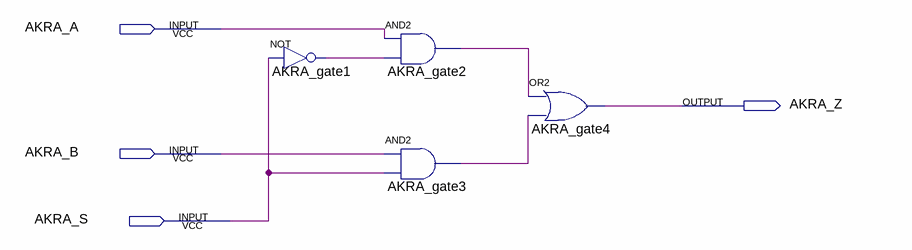
[diagram p0: schematic sheet]
// Quartus schematic Akram_Tutorial_MUX21_August_30_2021.bdf as structural Verilog: 4 symbols, 4 pins
module Akram_Tutorial_MUX21_August_30_2021 (
  input  AKRA_A,
  input  AKRA_B,
  input  AKRA_S,
  output AKRA_Z
);

  wire AKRA_gate1_out, AKRA_gate2_out, AKRA_gate3_out;

  not AKRA_gate1 (AKRA_gate1_out, AKRA_S);
  and AKRA_gate2 (AKRA_gate2_out, AKRA_A, AKRA_gate1_out);
  and AKRA_gate3 (AKRA_gate3_out, AKRA_B, AKRA_S);
  or AKRA_gate4 (AKRA_Z, AKRA_gate2_out, AKRA_gate3_out);
endmodule
